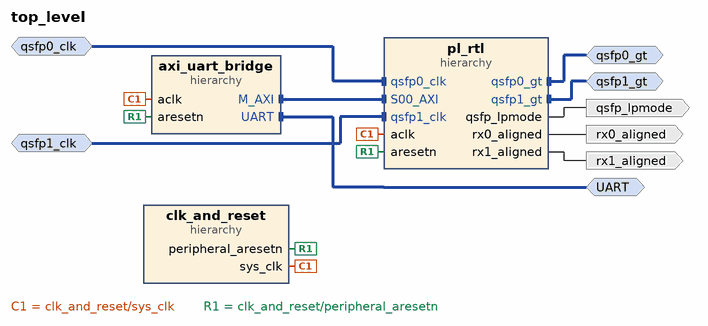
[diagram p0: block diagram of the top level]
# Vivado block design top_level, xcvp1202-vsva2785-2MP-e-S, Vivado 2024.2
create_bd_design top_level

create_bd_intf_port -mode Master -vlnv xilinx.com:interface:uart_rtl:1.0 UART
create_bd_intf_port -mode Master -vlnv xilinx.com:interface:gt_rtl:1.0 qsfp1_gt
create_bd_intf_port -mode Master -vlnv xilinx.com:interface:gt_rtl:1.0 qsfp0_gt
create_bd_intf_port -mode Slave -vlnv xilinx.com:interface:diff_clock_rtl:1.0 qsfp0_clk
set_property -dict {CONFIG.FREQ_HZ 156250000} [get_bd_intf_ports qsfp0_clk]
create_bd_intf_port -mode Slave -vlnv xilinx.com:interface:diff_clock_rtl:1.0 qsfp1_clk
set_property -dict {CONFIG.FREQ_HZ 156250000} [get_bd_intf_ports qsfp1_clk]
create_bd_port -dir O rx0_aligned
create_bd_port -dir O rx1_aligned
create_bd_port -dir O qsfp_lpmode

create_bd_cell -type hier pl_rtl
create_bd_cell -type hier axi_uart_bridge
create_bd_cell -type hier clk_and_reset

# ---- hierarchy /pl_rtl ----
current_bd_instance /pl_rtl
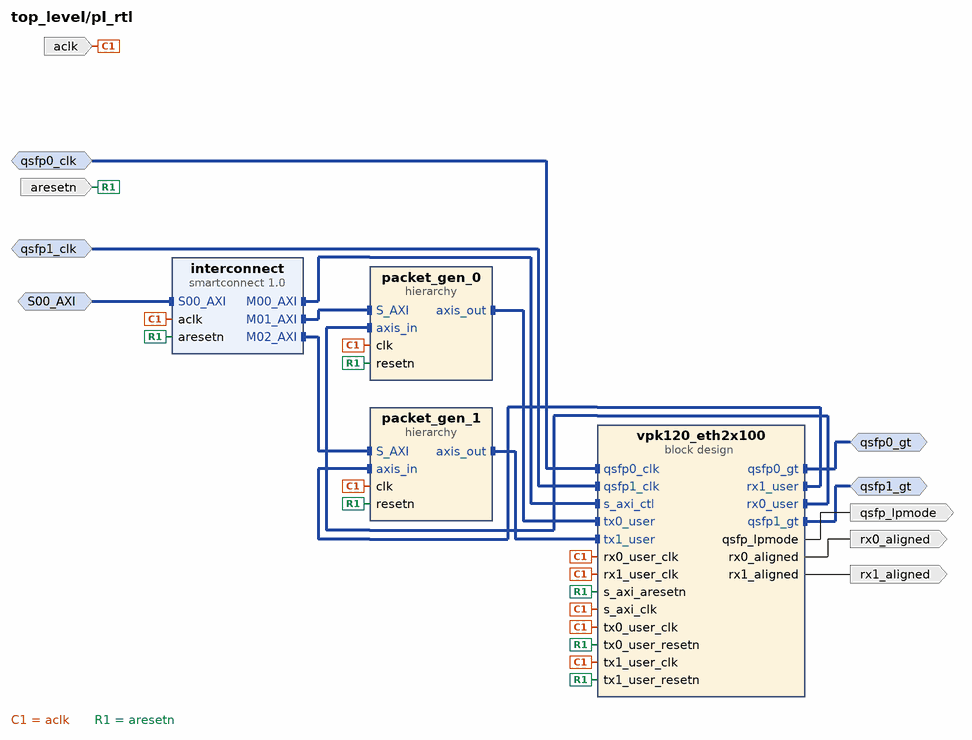
[diagram p1: block diagram inside /pl_rtl]
create_bd_intf_pin -mode Master -vlnv xilinx.com:interface:gt_rtl:1.0 qsfp1_gt
create_bd_intf_pin -mode Master -vlnv xilinx.com:interface:gt_rtl:1.0 qsfp0_gt
create_bd_intf_pin -mode Slave -vlnv xilinx.com:interface:diff_clock_rtl:1.0 qsfp0_clk
create_bd_intf_pin -mode Slave -vlnv xilinx.com:interface:diff_clock_rtl:1.0 qsfp1_clk
create_bd_intf_pin -mode Slave -vlnv xilinx.com:interface:aximm_rtl:1.0 S00_AXI
create_bd_pin -dir I -type clk aclk
create_bd_pin -dir I -type rst aresetn
create_bd_pin -dir O rx0_aligned
create_bd_pin -dir O rx1_aligned
create_bd_pin -dir O qsfp_lpmode

create_bd_cell -type ip -vlnv xilinx.com:ip:smartconnect:1.0 interconnect
set_property -dict {CONFIG.NUM_CLKS 1 CONFIG.NUM_MI 3 CONFIG.NUM_SI 1} [get_bd_cells interconnect]
create_bd_cell -type container -reference vpk120_eth2x100 vpk120_eth2x100
set_property -dict [list \
  CONFIG.ACTIVE_SIM_BD vpk120_eth2x100.bd \
  CONFIG.ACTIVE_SYNTH_BD vpk120_eth2x100.bd \
  CONFIG.ENABLE_DFX 0 \
  CONFIG.LIST_SIM_BD vpk120_eth2x100.bd \
  CONFIG.LIST_SYNTH_BD vpk120_eth2x100.bd \
  CONFIG.LOCK_PROPAGATE 0 \
] [get_bd_cells vpk120_eth2x100]
create_bd_cell -type hier packet_gen_0
create_bd_cell -type hier packet_gen_1

# ---- hierarchy /pl_rtl/packet_gen_0 ----
current_bd_instance /pl_rtl/packet_gen_0
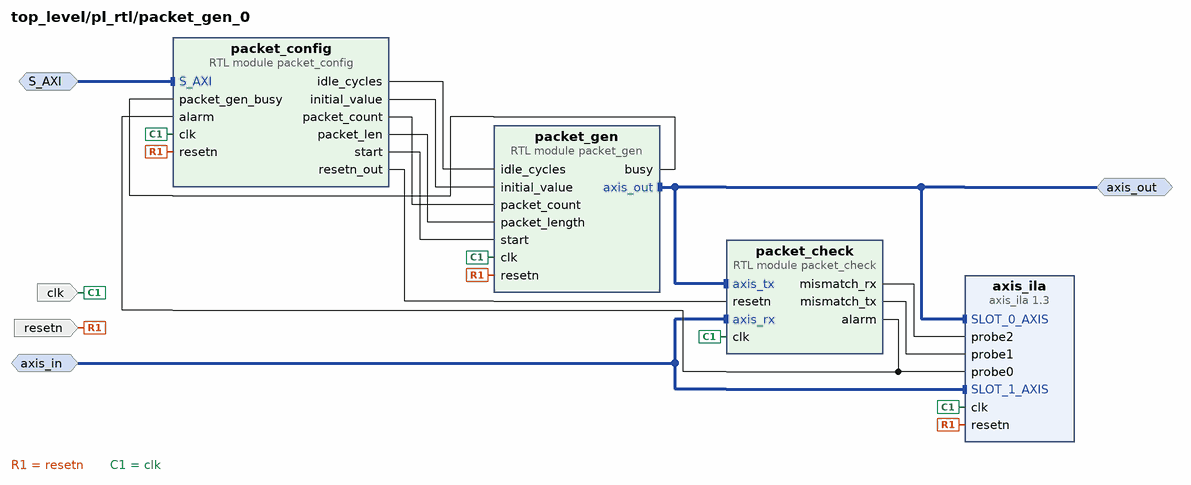
[diagram p2: block diagram inside /pl_rtl/packet_gen_0]
create_bd_intf_pin -mode Slave -vlnv xilinx.com:interface:aximm_rtl:1.0 S_AXI
create_bd_intf_pin -mode Master -vlnv xilinx.com:interface:axis_rtl:1.0 axis_out
create_bd_intf_pin -mode Slave -vlnv xilinx.com:interface:axis_rtl:1.0 axis_in
create_bd_pin -dir I -type clk clk
create_bd_pin -dir I resetn

create_bd_cell -type module -reference packet_config packet_config
create_bd_cell -type module -reference packet_gen packet_gen
create_bd_cell -type module -reference packet_check packet_check
create_bd_cell -type ip -vlnv xilinx.com:ip:axis_ila:1.3 axis_ila
set_property -dict [list \
  CONFIG.C_MON_TYPE Mixed \
  CONFIG.C_NUM_MONITOR_SLOTS 2 \
  CONFIG.C_NUM_OF_PROBES 3 \
  CONFIG.C_PROBE1_WIDTH 512 \
  CONFIG.C_PROBE2_WIDTH 512 \
  CONFIG.C_SLOT 1 \
  CONFIG.C_SLOT_0_INTF_TYPE xilinx.com:interface:axis_rtl:1.0 \
  CONFIG.C_SLOT_1_INTF_TYPE xilinx.com:interface:axis_rtl:1.0 \
] [get_bd_cells axis_ila]

# ---- hierarchy /pl_rtl/packet_gen_1 ----
current_bd_instance /pl_rtl/packet_gen_1
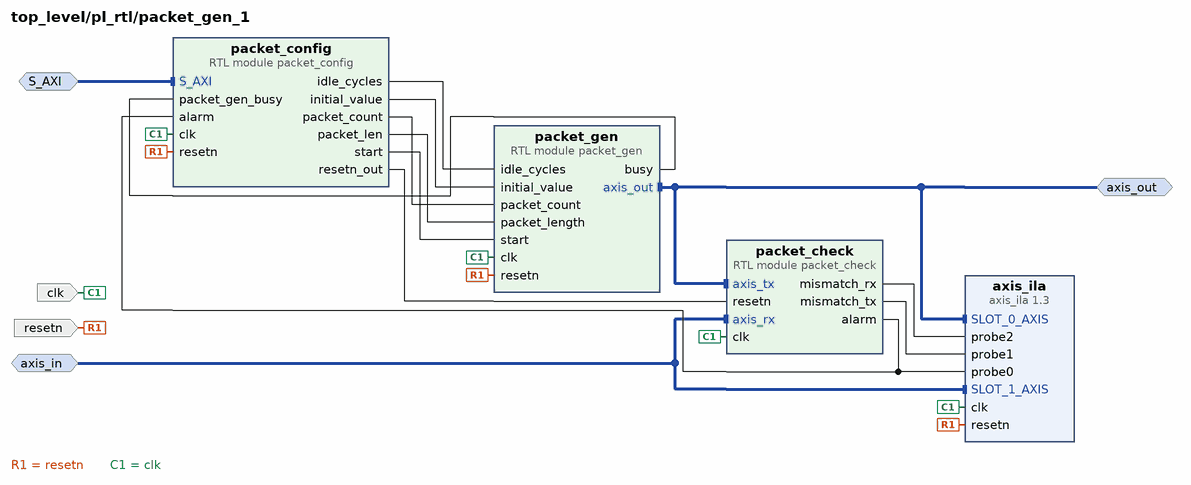
[diagram p3: block diagram inside /pl_rtl/packet_gen_1]
create_bd_intf_pin -mode Slave -vlnv xilinx.com:interface:aximm_rtl:1.0 S_AXI
create_bd_intf_pin -mode Master -vlnv xilinx.com:interface:axis_rtl:1.0 axis_out
create_bd_intf_pin -mode Slave -vlnv xilinx.com:interface:axis_rtl:1.0 axis_in
create_bd_pin -dir I -type clk clk
create_bd_pin -dir I resetn

create_bd_cell -type module -reference packet_config packet_config
create_bd_cell -type module -reference packet_gen packet_gen
create_bd_cell -type module -reference packet_check packet_check
create_bd_cell -type ip -vlnv xilinx.com:ip:axis_ila:1.3 axis_ila
set_property -dict [list \
  CONFIG.C_MON_TYPE Mixed \
  CONFIG.C_NUM_MONITOR_SLOTS 2 \
  CONFIG.C_NUM_OF_PROBES 3 \
  CONFIG.C_PROBE1_WIDTH 512 \
  CONFIG.C_PROBE2_WIDTH 512 \
  CONFIG.C_SLOT 1 \
  CONFIG.C_SLOT_0_INTF_TYPE xilinx.com:interface:axis_rtl:1.0 \
  CONFIG.C_SLOT_1_INTF_TYPE xilinx.com:interface:axis_rtl:1.0 \
] [get_bd_cells axis_ila]

# ---- hierarchy /axi_uart_bridge ----
current_bd_instance /axi_uart_bridge
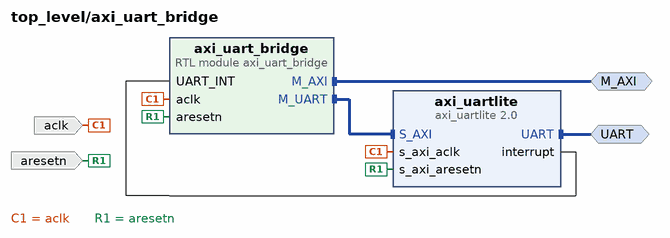
[diagram p4: block diagram inside /axi_uart_bridge]
create_bd_intf_pin -mode Master -vlnv xilinx.com:interface:uart_rtl:1.0 UART
create_bd_intf_pin -mode Master -vlnv xilinx.com:interface:aximm_rtl:1.0 M_AXI
create_bd_pin -dir I aclk
create_bd_pin -dir I aresetn

create_bd_cell -type module -reference axi_uart_bridge axi_uart_bridge
create_bd_cell -type ip -vlnv xilinx.com:ip:axi_uartlite:2.0 axi_uartlite
set_property -dict {CONFIG.C_BAUDRATE 115200} [get_bd_cells axi_uartlite]

# ---- hierarchy /clk_and_reset ----
current_bd_instance /clk_and_reset
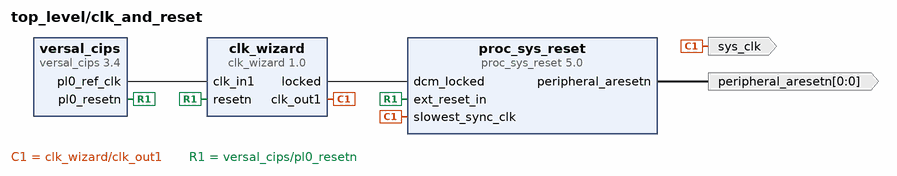
[diagram p5: block diagram inside /clk_and_reset]
create_bd_pin -dir O -from 0 -to 0 -type rst peripheral_aresetn
create_bd_pin -dir O sys_clk

create_bd_cell -type ip -vlnv xilinx.com:ip:clk_wizard:1.0 clk_wizard
set_property -dict [list \
  CONFIG.CLKOUT_DRIVES BUFG,BUFG,BUFG,BUFG,BUFG,BUFG,BUFG \
  CONFIG.CLKOUT_DYN_PS None,None,None,None,None,None,None \
  CONFIG.CLKOUT_GROUPING Auto,Auto,Auto,Auto,Auto,Auto,Auto \
  CONFIG.CLKOUT_MATCHED_ROUTING false,false,false,false,false,false,false \
  CONFIG.CLKOUT_PORT clk_out1,clk_out2,clk_out3,clk_out4,clk_out5,clk_out6,clk_out7 \
  CONFIG.CLKOUT_REQUESTED_DUTY_CYCLE 50.000,50.000,50.000,50.000,50.000,50.000,50.000 \
  CONFIG.CLKOUT_REQUESTED_OUT_FREQUENCY 249.9975,150.000,300.000,100.000,100.000,100.000,100.000 \
  CONFIG.CLKOUT_REQUESTED_PHASE 0.000,0.000,0.000,0.000,0.000,0.000,0.000 \
  CONFIG.CLKOUT_USED true,false,false,false,false,false,false \
  CONFIG.JITTER_SEL Min_O_Jitter \
  CONFIG.PRIM_SOURCE No_buffer \
  CONFIG.RESET_TYPE ACTIVE_LOW \
  CONFIG.USE_LOCKED true \
  CONFIG.USE_PHASE_ALIGNMENT true \
  CONFIG.USE_RESET true \
] [get_bd_cells clk_wizard]
create_bd_cell -type ip -vlnv xilinx.com:ip:versal_cips:3.4 versal_cips
set_property -dict [list \
  CONFIG.DDR_MEMORY_MODE Custom \
  CONFIG.DEBUG_MODE JTAG \
  CONFIG.DESIGN_MODE 0 \
  CONFIG.PS_BOARD_INTERFACE Custom \
  CONFIG.PS_PMC_CONFIG {['DEBUG_MODE JTAG DESIGN_MODE 0 PS_BOARD_INTERFACE Custom PS_HSDP_EGRESS_TRAFFIC JTAG PS_HSDP_INGRESS_TRAFFIC JTAG PS_HSDP_MODE NONE PS_NUM_FABRIC_RESETS 1 PS_USE_PMCPL_CLK0 1 SMON_ALARMS Set_Alarms_On', 'SMON_ENABLE_TEMP_AVERAGING 0 SMON_TEMP_AVERAGING_SAMPLES 0']} \
] [get_bd_cells versal_cips]
create_bd_cell -type ip -vlnv xilinx.com:ip:proc_sys_reset:5.0 proc_sys_reset

# ---- connections ----

current_bd_instance /pl_rtl
connect_bd_intf_net [get_bd_intf_pins interconnect/S00_AXI] [get_bd_intf_pins S00_AXI]
connect_bd_intf_net [get_bd_intf_pins packet_gen_0/S_AXI] [get_bd_intf_pins interconnect/M01_AXI]
connect_bd_intf_net [get_bd_intf_pins packet_gen_1/S_AXI] [get_bd_intf_pins interconnect/M02_AXI]
connect_bd_intf_net [get_bd_intf_pins packet_gen_1/axis_in] [get_bd_intf_pins vpk120_eth2x100/rx1_user]
connect_bd_intf_net [get_bd_intf_pins packet_gen_0/axis_out] [get_bd_intf_pins vpk120_eth2x100/tx0_user]
connect_bd_intf_net [get_bd_intf_pins packet_gen_1/axis_out] [get_bd_intf_pins vpk120_eth2x100/tx1_user]
connect_bd_intf_net [get_bd_intf_pins qsfp0_clk] [get_bd_intf_pins vpk120_eth2x100/qsfp0_clk]
connect_bd_intf_net [get_bd_intf_pins qsfp1_clk] [get_bd_intf_pins vpk120_eth2x100/qsfp1_clk]
connect_bd_intf_net [get_bd_intf_pins vpk120_eth2x100/s_axi_ctl] [get_bd_intf_pins interconnect/M00_AXI]
connect_bd_intf_net -intf_net vpk120_eth2x100_0_GT_Serial_0 [get_bd_intf_pins qsfp0_gt] [get_bd_intf_pins vpk120_eth2x100/qsfp0_gt]
connect_bd_intf_net -intf_net vpk120_eth2x100_0_GT_Serial_1 [get_bd_intf_pins qsfp1_gt] [get_bd_intf_pins vpk120_eth2x100/qsfp1_gt]
connect_bd_intf_net [get_bd_intf_pins vpk120_eth2x100/rx0_user] [get_bd_intf_pins packet_gen_0/axis_in]
connect_bd_net -net clk_wizard_0_clk_out1 [get_bd_pins aclk] \
  [get_bd_pins interconnect/aclk] [get_bd_pins packet_gen_0/clk] [get_bd_pins vpk120_eth2x100/s_axi_clk] \
  [get_bd_pins vpk120_eth2x100/tx1_user_clk] [get_bd_pins vpk120_eth2x100/tx0_user_clk] \
  [get_bd_pins vpk120_eth2x100/rx1_user_clk] [get_bd_pins packet_gen_1/clk] [get_bd_pins vpk120_eth2x100/rx0_user_clk]
connect_bd_net -net proc_sys_reset_0_peripheral_aresetn [get_bd_pins aresetn] \
  [get_bd_pins interconnect/aresetn] [get_bd_pins vpk120_eth2x100/s_axi_aresetn] [get_bd_pins packet_gen_0/resetn] \
  [get_bd_pins vpk120_eth2x100/tx1_user_resetn] [get_bd_pins vpk120_eth2x100/tx0_user_resetn] \
  [get_bd_pins packet_gen_1/resetn]
connect_bd_net [get_bd_pins vpk120_eth2x100/qsfp_lpmode] [get_bd_pins qsfp_lpmode]
connect_bd_net [get_bd_pins vpk120_eth2x100/rx0_aligned] [get_bd_pins rx0_aligned]
connect_bd_net [get_bd_pins vpk120_eth2x100/rx1_aligned] [get_bd_pins rx1_aligned]
set_property PFM.AXI_PORT {M04_AXI { memport "M_AXI_GP" sptag "" memory "" } } [get_bd_cells interconnect]

current_bd_instance /pl_rtl/packet_gen_0
connect_bd_intf_net [get_bd_intf_pins S_AXI] [get_bd_intf_pins packet_config/S_AXI]
connect_bd_intf_net [get_bd_intf_pins axis_in] [get_bd_intf_pins packet_check/axis_rx]
connect_bd_intf_net [get_bd_intf_pins axis_in] [get_bd_intf_pins axis_ila/SLOT_1_AXIS]
connect_bd_intf_net [get_bd_intf_pins axis_out] [get_bd_intf_pins packet_gen/axis_out]
connect_bd_intf_net [get_bd_intf_pins axis_out] [get_bd_intf_pins axis_ila/SLOT_0_AXIS]
connect_bd_intf_net [get_bd_intf_pins axis_out] [get_bd_intf_pins packet_check/axis_tx]
connect_bd_net [get_bd_pins packet_check/alarm] [get_bd_pins axis_ila/probe0] [get_bd_pins packet_config/alarm]
connect_bd_net [get_bd_pins packet_check/mismatch_rx] [get_bd_pins axis_ila/probe2]
connect_bd_net [get_bd_pins packet_check/mismatch_tx] [get_bd_pins axis_ila/probe1]
connect_bd_net [get_bd_pins packet_config/idle_cycles] [get_bd_pins packet_gen/idle_cycles]
connect_bd_net [get_bd_pins packet_config/initial_value] [get_bd_pins packet_gen/initial_value]
connect_bd_net [get_bd_pins packet_config/packet_count] [get_bd_pins packet_gen/packet_count]
connect_bd_net [get_bd_pins packet_config/packet_len] [get_bd_pins packet_gen/packet_length]
connect_bd_net [get_bd_pins packet_config/resetn_out] [get_bd_pins packet_check/resetn]
connect_bd_net [get_bd_pins packet_config/start] [get_bd_pins packet_gen/start]
connect_bd_net [get_bd_pins packet_gen/busy] [get_bd_pins packet_config/packet_gen_busy]
connect_bd_net [get_bd_pins resetn] [get_bd_pins packet_gen/resetn] [get_bd_pins axis_ila/resetn] [get_bd_pins packet_config/resetn]
connect_bd_net -net vpk120_eth2x100_axis_clk [get_bd_pins clk] \
  [get_bd_pins packet_gen/clk] [get_bd_pins axis_ila/clk] [get_bd_pins packet_check/clk] [get_bd_pins packet_config/clk]

current_bd_instance /pl_rtl/packet_gen_1
connect_bd_intf_net [get_bd_intf_pins S_AXI] [get_bd_intf_pins packet_config/S_AXI]
connect_bd_intf_net [get_bd_intf_pins axis_in] [get_bd_intf_pins packet_check/axis_rx]
connect_bd_intf_net [get_bd_intf_pins axis_in] [get_bd_intf_pins axis_ila/SLOT_1_AXIS]
connect_bd_intf_net [get_bd_intf_pins axis_out] [get_bd_intf_pins packet_gen/axis_out]
connect_bd_intf_net [get_bd_intf_pins axis_out] [get_bd_intf_pins axis_ila/SLOT_0_AXIS]
connect_bd_intf_net [get_bd_intf_pins axis_out] [get_bd_intf_pins packet_check/axis_tx]
connect_bd_net [get_bd_pins packet_check/alarm] [get_bd_pins axis_ila/probe0] [get_bd_pins packet_config/alarm]
connect_bd_net [get_bd_pins packet_check/mismatch_rx] [get_bd_pins axis_ila/probe2]
connect_bd_net [get_bd_pins packet_check/mismatch_tx] [get_bd_pins axis_ila/probe1]
connect_bd_net [get_bd_pins packet_config/idle_cycles] [get_bd_pins packet_gen/idle_cycles]
connect_bd_net [get_bd_pins packet_config/initial_value] [get_bd_pins packet_gen/initial_value]
connect_bd_net [get_bd_pins packet_config/packet_count] [get_bd_pins packet_gen/packet_count]
connect_bd_net [get_bd_pins packet_config/packet_len] [get_bd_pins packet_gen/packet_length]
connect_bd_net [get_bd_pins packet_config/resetn_out] [get_bd_pins packet_check/resetn]
connect_bd_net [get_bd_pins packet_config/start] [get_bd_pins packet_gen/start]
connect_bd_net [get_bd_pins packet_gen/busy] [get_bd_pins packet_config/packet_gen_busy]
connect_bd_net [get_bd_pins resetn] [get_bd_pins packet_gen/resetn] [get_bd_pins axis_ila/resetn] [get_bd_pins packet_config/resetn]
connect_bd_net -net vpk120_eth2x100_axis_clk [get_bd_pins clk] \
  [get_bd_pins packet_gen/clk] [get_bd_pins axis_ila/clk] [get_bd_pins packet_check/clk] [get_bd_pins packet_config/clk]

current_bd_instance /axi_uart_bridge
connect_bd_intf_net [get_bd_intf_pins M_AXI] [get_bd_intf_pins axi_uart_bridge/M_AXI]
connect_bd_intf_net [get_bd_intf_pins axi_uartlite/S_AXI] [get_bd_intf_pins axi_uart_bridge/M_UART]
connect_bd_intf_net -intf_net axi_uartlite_0_UART [get_bd_intf_pins UART] [get_bd_intf_pins axi_uartlite/UART]
connect_bd_net [get_bd_pins aclk] [get_bd_pins axi_uart_bridge/aclk] [get_bd_pins axi_uartlite/s_axi_aclk]
connect_bd_net [get_bd_pins aresetn] [get_bd_pins axi_uart_bridge/aresetn] [get_bd_pins axi_uartlite/s_axi_aresetn]
connect_bd_net [get_bd_pins axi_uartlite/interrupt] [get_bd_pins axi_uart_bridge/UART_INT]

current_bd_instance /clk_and_reset
connect_bd_net [get_bd_pins clk_wizard/clk_out1] [get_bd_pins sys_clk] [get_bd_pins proc_sys_reset/slowest_sync_clk]
connect_bd_net [get_bd_pins clk_wizard/locked] [get_bd_pins proc_sys_reset/dcm_locked]
connect_bd_net -net proc_sys_reset_0_peripheral_aresetn [get_bd_pins proc_sys_reset/peripheral_aresetn] [get_bd_pins peripheral_aresetn]
connect_bd_net [get_bd_pins versal_cips/pl0_ref_clk] [get_bd_pins clk_wizard/clk_in1]
connect_bd_net [get_bd_pins versal_cips/pl0_resetn] [get_bd_pins clk_wizard/resetn] [get_bd_pins proc_sys_reset/ext_reset_in]
set_property PFM.CLOCK {clk_out1 {id "0" is_default "true" proc_sys_reset "" status "fixed"}} [get_bd_cells clk_wizard]

current_bd_instance /
connect_bd_intf_net -intf_net CLK_IN_D_0_0_1 [get_bd_intf_ports qsfp0_clk] [get_bd_intf_pins pl_rtl/qsfp0_clk]
connect_bd_intf_net -intf_net CLK_IN_D_1_0_1 [get_bd_intf_ports qsfp1_clk] [get_bd_intf_pins pl_rtl/qsfp1_clk]
connect_bd_intf_net [get_bd_intf_pins axi_uart_bridge/M_AXI] [get_bd_intf_pins pl_rtl/S00_AXI]
connect_bd_intf_net [get_bd_intf_ports UART] [get_bd_intf_pins axi_uart_bridge/UART]
connect_bd_intf_net -intf_net pl_rtl_GT_Serial_0_0 [get_bd_intf_ports qsfp0_gt] [get_bd_intf_pins pl_rtl/qsfp0_gt]
connect_bd_intf_net -intf_net pl_rtl_GT_Serial_1_0 [get_bd_intf_ports qsfp1_gt] [get_bd_intf_pins pl_rtl/qsfp1_gt]
connect_bd_net -net clk_wizard_0_clk_out1 [get_bd_pins clk_and_reset/sys_clk] [get_bd_pins pl_rtl/aclk] [get_bd_pins axi_uart_bridge/aclk]
connect_bd_net [get_bd_pins pl_rtl/qsfp_lpmode] [get_bd_ports qsfp_lpmode]
connect_bd_net [get_bd_pins pl_rtl/rx0_aligned] [get_bd_ports rx0_aligned]
connect_bd_net [get_bd_pins pl_rtl/rx1_aligned] [get_bd_ports rx1_aligned]
connect_bd_net -net proc_sys_reset_0_peripheral_aresetn [get_bd_pins clk_and_reset/peripheral_aresetn] \
  [get_bd_pins pl_rtl/aresetn] [get_bd_pins axi_uart_bridge/aresetn]

# ---- address map ----
assign_bd_address -offset 0x0000000000001000 -range 4K -target_address_space [get_bd_addr_spaces axi_uart_bridge/axi_uart_bridge/M_AXI] [get_bd_addr_segs pl_rtl/packet_gen_0/packet_config/S_AXI/reg0]
assign_bd_address -offset 0x0000000000002000 -range 4K -target_address_space [get_bd_addr_spaces axi_uart_bridge/axi_uart_bridge/M_AXI] [get_bd_addr_segs pl_rtl/packet_gen_1/packet_config/S_AXI/reg0]
assign_bd_address -offset 0x00000000A4100000 -range 4K -target_address_space [get_bd_addr_spaces axi_uart_bridge/axi_uart_bridge/M_AXI] [get_bd_addr_segs pl_rtl/vpk120_eth2x100/dcmac_ctrl/S_AXI/reg0]
assign_bd_address -offset 0x40600000 -range 64K -target_address_space [get_bd_addr_spaces axi_uart_bridge/axi_uart_bridge/M_UART] [get_bd_addr_segs axi_uart_bridge/axi_uartlite/S_AXI/Reg]
assign_bd_address -offset 0xA4000000 -range 1M -target_address_space [get_bd_addr_spaces pl_rtl/vpk120_eth2x100/dcmac_ctrl/M_AXI] [get_bd_addr_segs pl_rtl/vpk120_eth2x100/dcmac_ip/dcmac_0/s_axi/Reg]
assign_bd_address -offset 0xA4000000 -range 1M -target_address_space [get_bd_addr_spaces pl_rtl/vpk120_eth2x100/dcmac_iface/M_AXI] [get_bd_addr_segs pl_rtl/vpk120_eth2x100/dcmac_ip/dcmac_0/s_axi/Reg]

validate_bd_design
save_bd_design
